# EAGLE schematic POE_RS-485 (EAGLE 6.4)
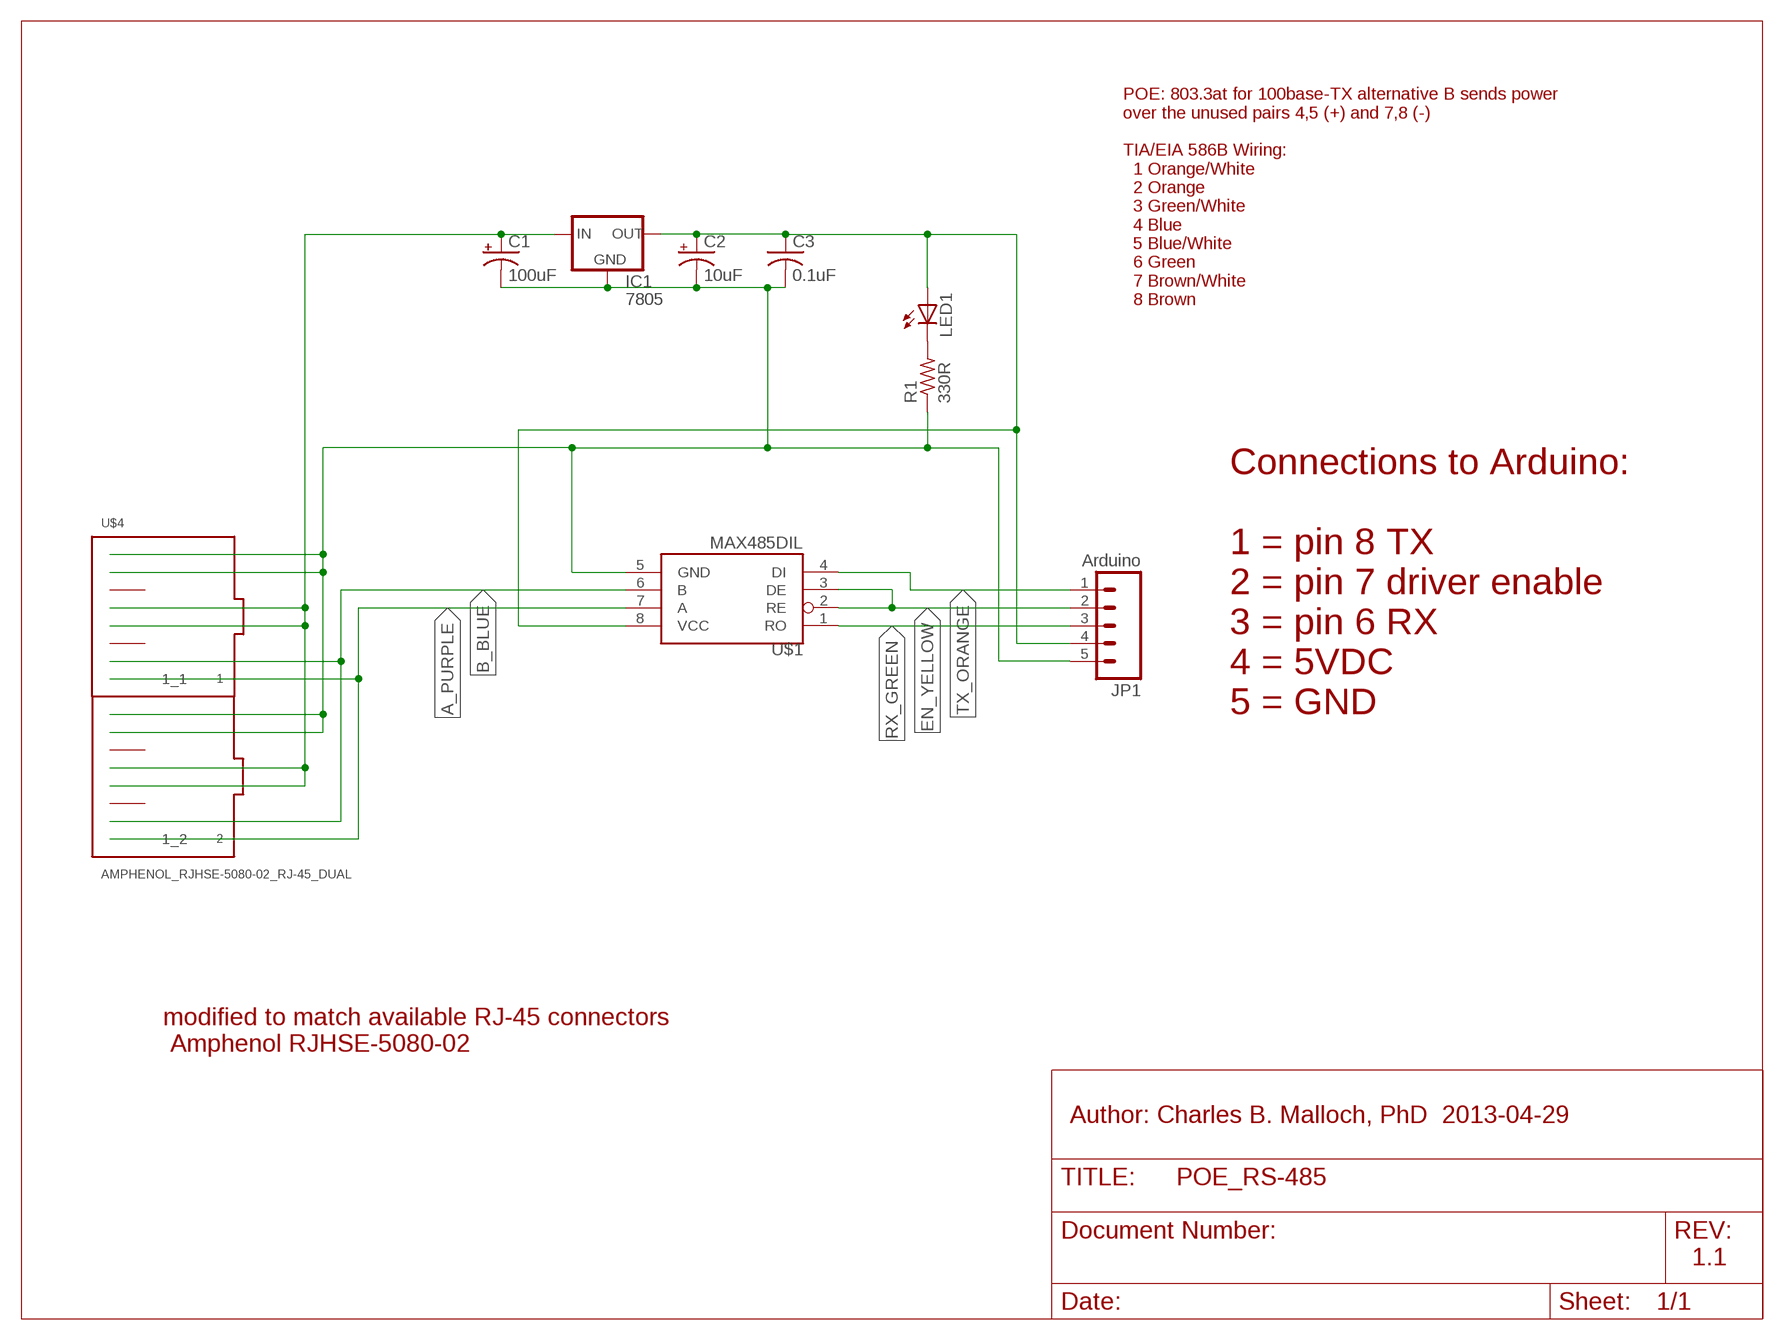
[diagram p0: schematic, sheet 1]

## Parts
C1  100uF  CPOL-USTT2D7  [TT2D7]
C2  10uF  CPOL-USE1.8-4  [E1,8-4]
C3  0.1uF  C-US025-025X050  [C025-025X050]
IC1  7805  V_REG_78XX-TO-220  [TO-220-ALT]
JP1  Arduino  M05LOCK_LONGPADS  [1X05_LOCK_LONGPADS]
LED1  LED3MM  [LED3MM]
R1  330R  R-US_0204/7  [0204/7]
U$1  MAX485DIL  [DIL08]
U$4  AMPHENOL_RJHSE-5080-02_RJ-45_DUAL  [AMPHENOL_RJHSE-5080-02]

## Nets
A_PURPLE: U$1.7(A) U$4.TX_D1+_2(1_2) U$4.TX_DI+_1(1_1)
B_BLUE: U$1.6(B) U$4.TX_D1-_2(2_2) U$4.TX_DI-_1(2_1)
EN_YELLOW: JP1.2 U$1.2(RE) U$1.3(DE)
GND [POWER]: C1.- C2.- C3.2 IC1.GND JP1.5 R1.1 U$1.5(GND) U$4.POE-_1_1(7_1) U$4.POE-_1_2(7_2) U$4.POE-_2_1(8_1) U$4.POE-_2_2(8_2)
N$1: LED1.K(C) R1.2
PWR [POWER]: C2.+ C3.1 IC1.OUT JP1.4 LED1.A U$1.8(VCC)
RX_GREEN: JP1.3 U$1.1(RO)
TX_ORANGE: JP1.1 U$1.4(DI)
VIN [POWER]: C1.+ IC1.IN U$4.POE+_1_1(4_1) U$4.POE+_1_2(4_2) U$4.POE+_2_1(5_1) U$4.POE+_2_2(5_2)
Unconnected: U$4.RX_D2+_1(3_1) U$4.RX_D2+_2(3_2) U$4.RX_D2-_1(6_1) U$4.RX_D2-_2(6_2)

## Notes on the sheet
- POE: 803.3at for 100base-TX alternative B sends power 
  over the unused pairs 4,5 (+) and 7,8 (-)
  
  TIA/EIA 586B Wiring:
    1 Orange/White
    2 Orange
    3 Green/White
    4 Blue
    5 Blue/White
    6 Green
    7 Brown/White
    8 Brown
- Connections to Arduino:
  
  1 = pin 8 TX
  2 = pin 7 driver enable
  3 = pin 6 RX
  4 = 5VDC
  5 = GND
- modified to match available RJ-45 connectors
   Amphenol RJHSE-5080-02
- Author: Charles B. Malloch, PhD  2013-04-29
- 1.1

## Library data of the parts
C1 C2 = adafruit:CPOL-US: POLARIZED CAPACITOR, American symbol
C3 = adafruit:C-US: CAPACITOR, American symbol
IC1 = SparkFun-PowerIC:V_REG_78XX: Voltage Regulator Standard 7805 5V regulator. IGO (Input Ground Output). Spark Fun Electronics SKU : COM-00107
JP1 = SparkFun-Connectors:M05: Header 5 Standard 5-pin 0.1" header. Use with straight break away headers (SKU : PRT-00116), right angle break away headers (PRT-00553), swiss pins (PRT-00743), machine pins (PRT-00117), and female headers (PRT-00115). Molex polarized connector foot print use with SKU : PRT-08230 with associated crimp pins and housings.
LED1 = led:LED: LED OSRAM: - CHIPLED LG R971, LG N971, LY N971, LG Q971, LY Q971, LO R971, LY R971 LH N974, LH R974 LS Q976, LO Q976, LY Q976 LO Q996 - Hyper CHIPLED LW Q18S LB Q993, LB Q99A, LB R99A - SideLED LS A670, LO A670, LY A670, LG A670, LP A670 LB A673, LV A673, LT A673, LW A673 LH A674 LY A675 LS A676, LA A676, LO A676, LY A676, LW A676 LS A679, LY A679, LG A679 - Hyper Micro SIDELED® LS Y876, LA Y876, LO Y876, LY Y876 LT Y87S - SmartLED LW L88C, LW L88S LB L89C, LB L89S, LG L890 LS L89K, LO L89K, LY L89K LS L896, LA L896, LO L896, LY L896 - TOPLED LS T670, LO T670, LY T670, LG T670, LP T670 LSG T670, LSP T670, LSY T670, LOP T670, LYG T670 LG T671, LOG T671, LSG T671 LB T673, LV T673, LT T673, LW T673 LH T674 LS T676, LA T676, LO T676, LY T676, LB T676, LH T676, LSB T676, LW T676 LB T67C, LV T67C, LT T67C, LS T67K, LO T67K, LY T67K, LW E67C LS E67B, LA E67B, LO E67B, LY E67B, LB E67C, LV E67C, LT E67C LW T67C LS T679, LY T679, LG T679 LS T770, LO T770, LY T770, LG T770, LP T770 LB T773, LV T773, LT T773, LW T773 LH T774 LS E675, LA E675, LY E675, LS T675 LS T776, LA T776, LO T776, LY T776, LB T776 LHGB T686 LT T68C, LB T68C - Hyper Mini TOPLED® LB M676 - Mini TOPLED Santana® LG M470 LS M47K, LO M47K, LY M47K Source: http://www.osram.convergy.de LUXEON: - LUMILED® LXK2-PW12-R00, LXK2-PW12-S00, LXK2-PW14-U00, LXK2-PW14-V00 LXK2-PM12-R00, LXK2-PM12-S00, LXK2-PM14-U00 LXK2-PE12-Q00, LXK2-PE12-R00, LXK2-PE12-S00, LXK2-PE14-T00, LXK2-PE14-U00 LXK2-PB12-K00, LXK2-PB12-L00, LXK2-PB12-M00, LXK2-PB14-N00, LXK2-PB14-P00, LXK2-PB14-Q00 LXK2-PR12-L00, LXK2-PR12-M00, LXK2-PR14-Q00, LXK2-PR14-R00 LXK2-PD12-Q00, LXK2-PD12-R00, LXK2-PD12-S00 LXK2-PH12-R00, LXK2-PH12-S00 LXK2-PL12-P00, LXK2-PL12-Q00, LXK2-PL12-R00 Source: www.luxeon.com KINGBRIGHT: KA-3528ASYC Source: www.kingbright.com
R1 = resistor:R-US_: RESISTOR, American symbol
U$1 = SparkFun-DigitalIC:MAX485: RS-485 transceiver
U$4 = cbm_parts:AMPHENOL_RJHSE-5080-02_RJ-45_DUAL: Amphenol RJHSE-5080-02 RJ-45 dual

## Net classes
1 POWER: width 0.61 mm, clearance 0.305 mm